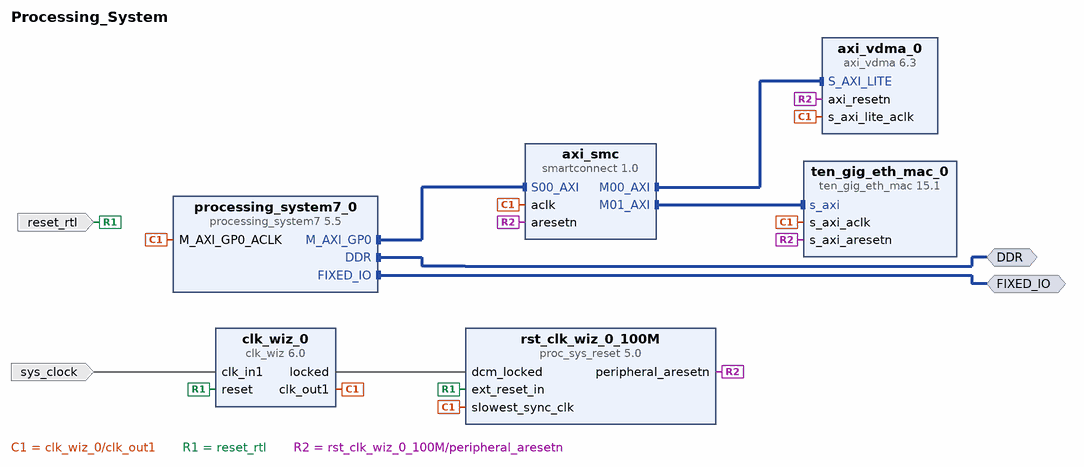
[diagram p0: block diagram of the top level]
# Vivado block design Processing_System, xc7z020clg400-1, Vivado 2025.2
create_bd_design Processing_System

create_bd_intf_port -mode Master -vlnv xilinx.com:interface:ddrx_rtl:1.0 DDR
create_bd_intf_port -mode Master -vlnv xilinx.com:display_processing_system7:fixedio_rtl:1.0 FIXED_IO
create_bd_port -dir I -type clk sys_clock
set_property -dict {CONFIG.FREQ_HZ 125000000 CONFIG.PHASE 0.0} [get_bd_ports sys_clock]
create_bd_port -dir I -type rst reset_rtl
set_property -dict {CONFIG.POLARITY ACTIVE_HIGH} [get_bd_ports reset_rtl]

create_bd_cell -type ip -vlnv xilinx.com:ip:processing_system7:5.5 processing_system7_0
set_property -dict [list \
  CONFIG.PCW_APU_PERIPHERAL_FREQMHZ 650 \
  CONFIG.PCW_CRYSTAL_PERIPHERAL_FREQMHZ 50 \
  CONFIG.PCW_ENET0_PERIPHERAL_ENABLE 0 \
  CONFIG.PCW_FPGA0_PERIPHERAL_FREQMHZ 100 \
  CONFIG.PCW_FPGA1_PERIPHERAL_FREQMHZ 50 \
  CONFIG.PCW_GPIO_MIO_GPIO_ENABLE 1 \
  CONFIG.PCW_GPIO_MIO_GPIO_IO MIO \
  CONFIG.PCW_I2C_RESET_ENABLE 1 \
  CONFIG.PCW_M_AXI_GP0_FREQMHZ 10 \
  CONFIG.PCW_PERIPHERAL_BOARD_PRESET None \
  CONFIG.PCW_PRESET_BANK1_VOLTAGE {LVCMOS 1.8V} \
  CONFIG.PCW_QSPI_GRP_FBCLK_ENABLE 1 \
  CONFIG.PCW_QSPI_GRP_FBCLK_IO {MIO 8} \
  CONFIG.PCW_QSPI_GRP_SINGLE_SS_ENABLE 1 \
  CONFIG.PCW_QSPI_GRP_SINGLE_SS_IO {MIO 1 .. 6} \
  CONFIG.PCW_QSPI_PERIPHERAL_ENABLE 1 \
  CONFIG.PCW_QSPI_QSPI_IO {MIO 1 .. 6} \
  CONFIG.PCW_SD0_PERIPHERAL_ENABLE 0 \
  CONFIG.PCW_SINGLE_QSPI_DATA_MODE x4 \
  CONFIG.PCW_UART1_PERIPHERAL_ENABLE 0 \
  CONFIG.PCW_UIPARAM_DDR_BUS_WIDTH {16 Bit} \
  CONFIG.PCW_UIPARAM_DDR_FREQ_MHZ 525 \
  CONFIG.PCW_UIPARAM_DDR_PARTNO {MT41J256M16 RE-125} \
  CONFIG.PCW_USB0_PERIPHERAL_ENABLE 0 \
  CONFIG.PCW_USB_RESET_ENABLE 1 \
] [get_bd_cells processing_system7_0]
# 470 more settings of processing_system7_0 are not shown: defaults, MIO pin electricals, DDR timing, and values the tool derives
create_bd_cell -type ip -vlnv xilinx.com:ip:clk_wiz:6.0 clk_wiz_0
set_property -dict [list \
  CONFIG.CLKIN1_JITTER_PS 80.0 \
  CONFIG.CLKOUT1_JITTER 124.615 \
  CONFIG.CLKOUT1_PHASE_ERROR 96.948 \
  CONFIG.CLK_IN1_BOARD_INTERFACE sys_clock \
  CONFIG.MMCM_CLKFBOUT_MULT_F 8.000 \
  CONFIG.MMCM_CLKIN1_PERIOD 8.000 \
  CONFIG.USE_BOARD_FLOW true \
] [get_bd_cells clk_wiz_0]
create_bd_cell -type ip -vlnv xilinx.com:ip:axi_vdma:6.3 axi_vdma_0
create_bd_cell -type ip -vlnv xilinx.com:ip:smartconnect:1.0 axi_smc
set_property -dict {CONFIG.NUM_MI 2 CONFIG.NUM_SI 1} [get_bd_cells axi_smc]
create_bd_cell -type ip -vlnv xilinx.com:ip:proc_sys_reset:5.0 rst_clk_wiz_0_100M
create_bd_cell -type ip -vlnv xilinx.com:ip:ten_gig_eth_mac:15.1 ten_gig_eth_mac_0

# ---- connections ----

connect_bd_intf_net [get_bd_intf_pins axi_smc/M00_AXI] [get_bd_intf_pins axi_vdma_0/S_AXI_LITE]
connect_bd_intf_net [get_bd_intf_pins axi_smc/M01_AXI] [get_bd_intf_pins ten_gig_eth_mac_0/s_axi]
connect_bd_intf_net [get_bd_intf_ports DDR] [get_bd_intf_pins processing_system7_0/DDR]
connect_bd_intf_net [get_bd_intf_ports FIXED_IO] [get_bd_intf_pins processing_system7_0/FIXED_IO]
connect_bd_intf_net [get_bd_intf_pins processing_system7_0/M_AXI_GP0] [get_bd_intf_pins axi_smc/S00_AXI]
connect_bd_net [get_bd_pins clk_wiz_0/clk_out1] \
  [get_bd_pins axi_smc/aclk] [get_bd_pins axi_vdma_0/s_axi_lite_aclk] [get_bd_pins ten_gig_eth_mac_0/s_axi_aclk] \
  [get_bd_pins processing_system7_0/M_AXI_GP0_ACLK] [get_bd_pins rst_clk_wiz_0_100M/slowest_sync_clk]
connect_bd_net [get_bd_pins clk_wiz_0/locked] [get_bd_pins rst_clk_wiz_0_100M/dcm_locked]
connect_bd_net [get_bd_ports reset_rtl] [get_bd_pins clk_wiz_0/reset] [get_bd_pins rst_clk_wiz_0_100M/ext_reset_in]
connect_bd_net [get_bd_pins rst_clk_wiz_0_100M/peripheral_aresetn] \
  [get_bd_pins axi_vdma_0/axi_resetn] [get_bd_pins axi_smc/aresetn] [get_bd_pins ten_gig_eth_mac_0/s_axi_aresetn]
connect_bd_net [get_bd_ports sys_clock] [get_bd_pins clk_wiz_0/clk_in1]

# ---- address map ----
assign_bd_address -offset 0x43000000 -range 64K -target_address_space [get_bd_addr_spaces processing_system7_0/Data] [get_bd_addr_segs axi_vdma_0/S_AXI_LITE/Reg]
assign_bd_address -offset 0x43C00000 -range 64K -target_address_space [get_bd_addr_spaces processing_system7_0/Data] [get_bd_addr_segs ten_gig_eth_mac_0/s_axi/Reg]

validate_bd_design
save_bd_design
